# EAGLE schematic Placa sensores (EAGLE 7.5.0)
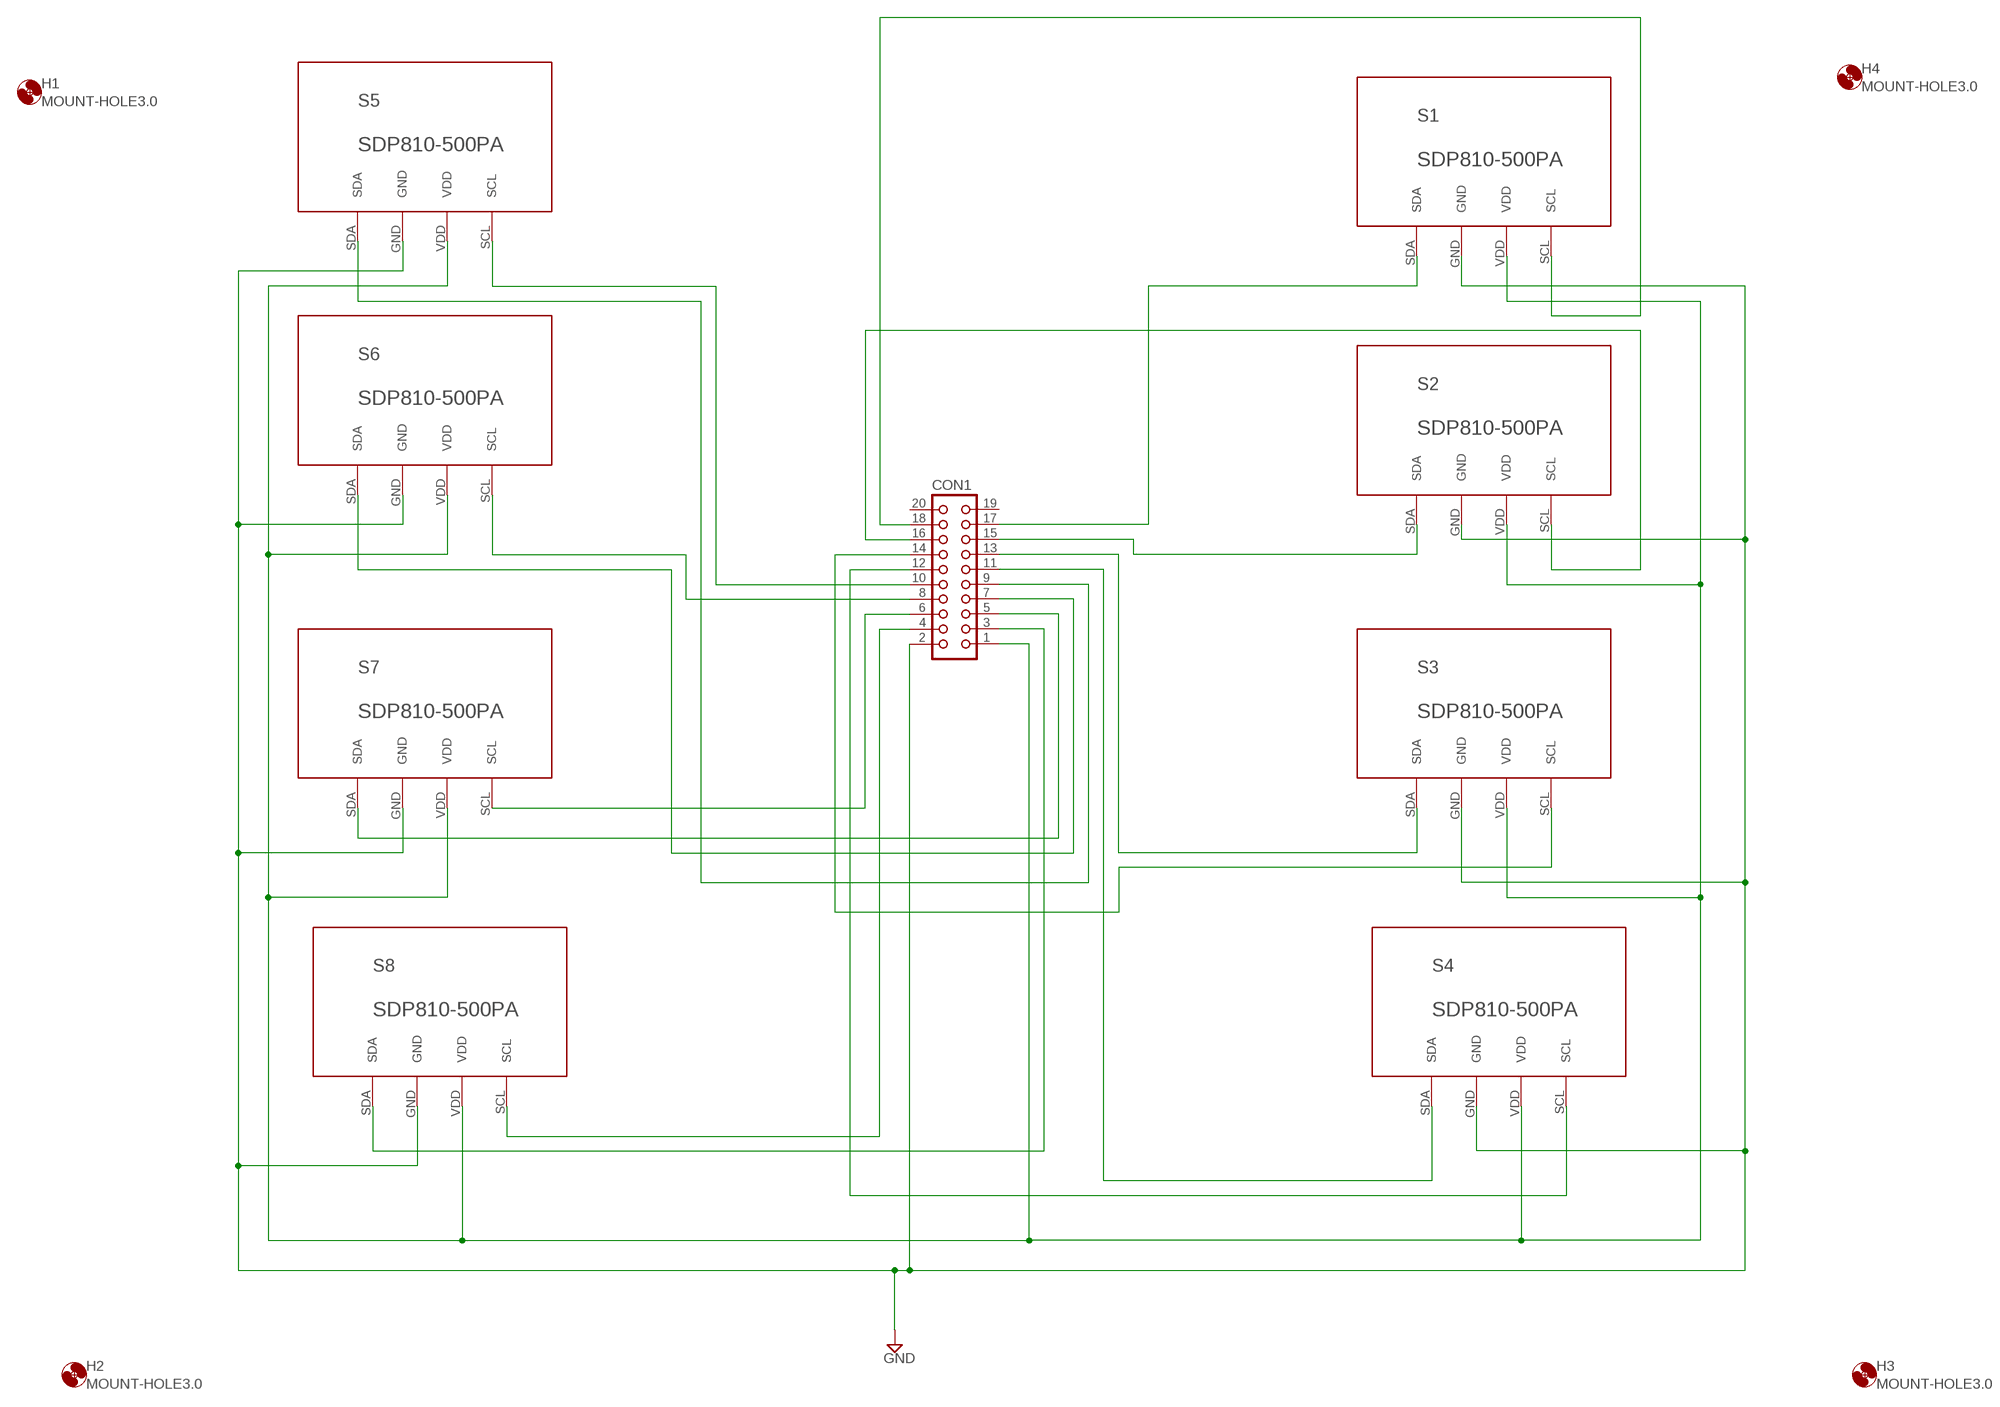
[diagram p0: schematic, sheet 1]

## Parts
CON1  CON20  [CON20]
H1  MOUNT-HOLE3.0  [3,0]
H2  MOUNT-HOLE3.0  [3,0]
H3  MOUNT-HOLE3.0  [3,0]
H4  MOUNT-HOLE3.0  [3,0]
S1  SDP810-500PA  [SDP810-500PA]
S2  SDP810-500PA  [SDP810-500PA]
S3  SDP810-500PA  [SDP810-500PA]
S4  SDP810-500PA  [SDP810-500PA]
S5  SDP810-500PA  [SDP810-500PA]
S6  SDP810-500PA  [SDP810-500PA]
S7  SDP810-500PA  [SDP810-500PA]
S8  SDP810-500PA  [SDP810-500PA]

## Nets
GND: CON1.2 S1.GND S2.GND S3.GND S4.GND S5.GND S6.GND S7.GND S8.GND
N$1: CON1.1 S1.VDD S2.VDD S3.VDD S4.VDD S5.VDD S6.VDD S7.VDD S8.VDD
N$2: CON1.4 S8.SCL
N$3: CON1.5 S7.SDA
N$4: CON1.6 S7.SCL
N$5: CON1.10 S5.SCL
N$6: CON1.9 S5.SDA
N$7: CON1.8 S6.SCL
N$9: CON1.3 S8.SDA
N$10: CON1.7 S6.SDA
N$11: CON1.12 S4.SCL
N$12: CON1.11 S4.SDA
N$13: CON1.14 S3.SCL
N$14: CON1.13 S3.SDA
N$15: CON1.17 S1.SDA
N$16: CON1.18 S1.SCL
N$17: CON1.16 S2.SCL
N$18: CON1.15 S2.SDA
Unconnected: CON1.19 CON1.20

## Library data of the parts
CON1 = con-harting:CON20: CONNECTOR; OC_FARNELL: unknown; OC_NEWARK: unknown
H1-H4 = holes:MOUNT-HOLE: MOUNTING HOLE with drill center marker
S1-S8 = CESAR:SDP810-500PA